# EAGLE schematic sensor (EAGLE 6.5.0)
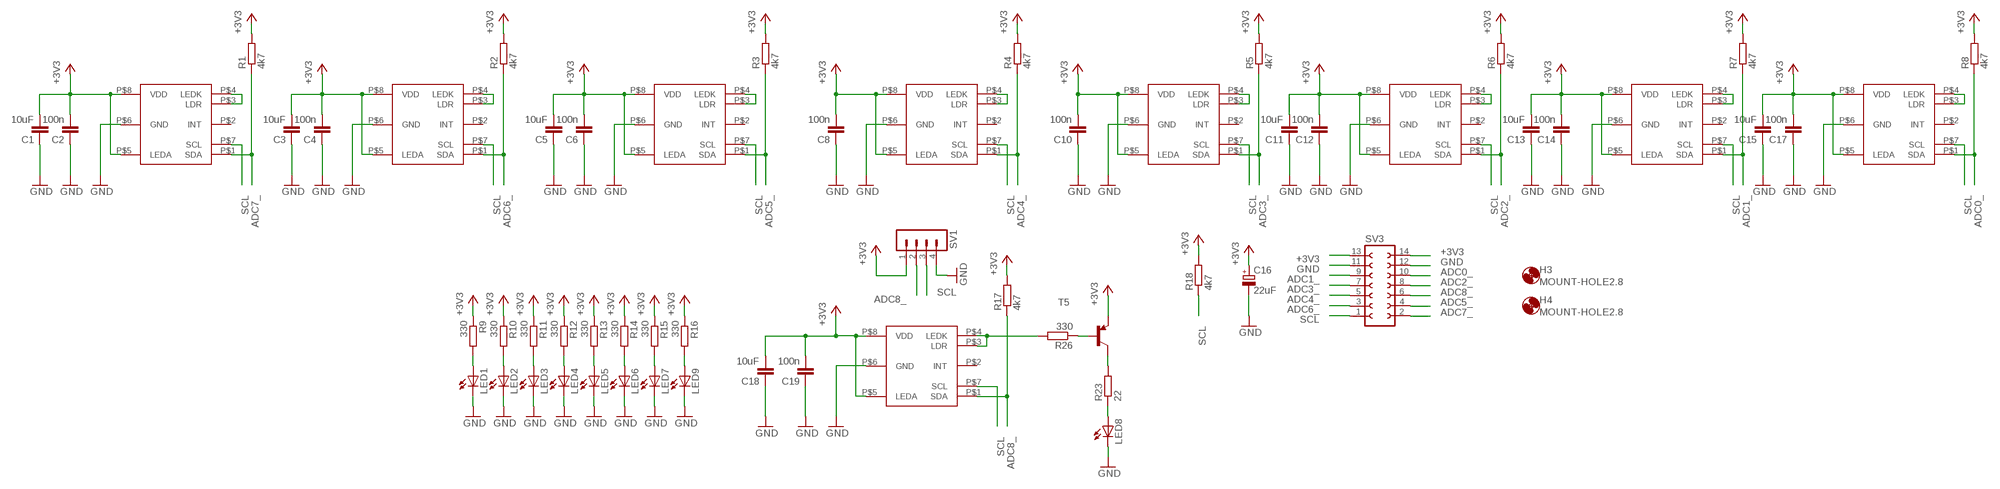
[diagram p0: schematic, sheet 1]

## Parts
C1  10uF  C-EUC0805  [C0805]
C2  100n  C-EUC0805  [C0805]
C3  10uF  C-EUC0805  [C0805]
C4  100n  C-EUC0805  [C0805]
C5  10uF  C-EUC0805  [C0805]
C6  100n  C-EUC0805  [C0805]
C8  100n  C-EUC0805  [C0805]
C10  100n  C-EUC0805  [C0805]
C11  10uF  C-EUC0805  [C0805]
C12  100n  C-EUC0805  [C0805]
C13  10uF  C-EUC0805  [C0805]
C14  100n  C-EUC0805  [C0805]
C15  10uF  C-EUC0805  [C0805]
C16  22uF  CPOL-EU153CLV-0505  [153CLV-0505]
C17  100n  C-EUC0805  [C0805]
C18  10uF  C-EUC0805  [C0805]
C19  100n  C-EUC0805  [C0805]
H3  MOUNT-HOLE2.8  [2,8]
H4  MOUNT-HOLE2.8  [2,8]
LED1  LEDCHIPLED_1206  [CHIPLED_1206]
LED2  LEDCHIPLED_1206  [CHIPLED_1206]
LED3  LEDCHIPLED_1206  [CHIPLED_1206]
LED4  LEDCHIPLED_1206  [CHIPLED_1206]
LED5  LEDCHIPLED_1206  [CHIPLED_1206]
LED6  LEDCHIPLED_1206  [CHIPLED_1206]
LED7  LEDCHIPLED_1206  [CHIPLED_1206]
LED8  LED5MM  [LED5MM]
LED9  LEDCHIPLED_1206  [CHIPLED_1206]
R1  4k7  R-EU_M0805  [M0805]
R2  4k7  R-EU_M0805  [M0805]
R3  4k7  R-EU_M0805  [M0805]
R4  4k7  R-EU_M0805  [M0805]
R5  4k7  R-EU_M0805  [M0805]
R6  4k7  R-EU_M0805  [M0805]
R7  4k7  R-EU_M0805  [M0805]
R8  4k7  R-EU_M0805  [M0805]
R9  330  R-EU_M0805  [M0805]
R10  330  R-EU_M0805  [M0805]
R11  330  R-EU_M0805  [M0805]
R12  330  R-EU_M0805  [M0805]
R13  330  R-EU_M0805  [M0805]
R14  330  R-EU_M0805  [M0805]
R15  330  R-EU_M0805  [M0805]
R16  330  R-EU_M0805  [M0805]
R17  4k7  R-EU_M0805  [M0805]
R18  4k7  R-EU_M0805  [M0805]
R23  22  R-EU_M0805  [M0805]
R26  330  R-EU_M0805  [M0805]
SV1  MA04-1  [MA04-1]
SV3  FE07-2  [FE07-2]
T5  BC857A-PNP-SOT23-BEC  [SOT23-BEC]
U$1  APDS9950  [APDS9950]
U$2  APDS9950_EDGE  [APDS9950_EDGE]
U$4  APDS9950  [APDS9950]
U$5  APDS9950  [APDS9950]
U$6  APDS9950  [APDS9950]
U$7  APDS9950  [APDS9950]
U$8  APDS9950  [APDS9950]
U$9  APDS9950  [APDS9950]
U$10  APDS9950  [APDS9950]

## Nets
+3V3: C1.2 C2.2 C3.2 C4.2 C5.2 C6.2 C8.2 C10.2 C11.2 C12.2 C13.2 C14.2 C15.2 C16.+ C17.2 C18.2 C19.2 R1.2 R2.2 R3.2 R4.2 R5.2 R6.2 R7.2 R8.2 R9.1 R10.1 R11.1 R12.1 R13.1 R14.1 R15.1 R16.1 R17.2 R18.2 SV1.1 SV3.13 SV3.14 T5.E U$1.P$5(LEDA) U$1.P$8(VDD) U$2.P$5(LEDA) U$2.P$8(VDD) U$4.P$5(LEDA) U$4.P$8(VDD) U$5.P$5(LEDA) U$5.P$8(VDD) U$6.P$5(LEDA) U$6.P$8(VDD) U$7.P$5(LEDA) U$7.P$8(VDD) U$8.P$5(LEDA) U$8.P$8(VDD) U$9.P$5(LEDA) U$9.P$8(VDD) U$10.P$5(LEDA) U$10.P$8(VDD)
ADC0_: R8.1 SV3.10 U$10.P$1(SDA)
ADC1_: R7.1 SV3.9 U$9.P$1(SDA)
ADC2_: R6.1 SV3.8 U$8.P$1(SDA)
ADC3_: R5.1 SV3.7 U$7.P$1(SDA)
ADC4_: R4.1 SV3.5 U$6.P$1(SDA)
ADC5_: R3.1 SV3.4 U$5.P$1(SDA)
ADC6_: R2.1 SV3.3 U$4.P$1(SDA)
ADC7_: R1.1 SV3.2 U$1.P$1(SDA)
ADC8_: R17.1 SV1.2 SV3.6 U$2.P$1(SDA)
GND: C1.1 C2.1 C3.1 C4.1 C5.1 C6.1 C8.1 C10.1 C11.1 C12.1 C13.1 C14.1 C15.1 C16.- C17.1 C18.1 C19.1 LED1.C LED2.C LED3.C LED4.C LED5.C LED6.C LED7.C LED8.K(C) LED9.C SV1.4 SV3.11 SV3.12 U$1.P$6(GND) U$2.P$6(GND) U$4.P$6(GND) U$5.P$6(GND) U$6.P$6(GND) U$7.P$6(GND) U$8.P$6(GND) U$9.P$6(GND) U$10.P$6(GND)
N$1: R23.2 T5.C
N$2: U$4.P$3(LDR) U$4.P$4(LEDK)
N$3: LED1.A R9.2
N$4: U$1.P$3(LDR) U$1.P$4(LEDK)
N$5: LED2.A R10.2
N$6: LED3.A R11.2
N$7: LED4.A R12.2
N$8: LED5.A R13.2
N$9: U$5.P$3(LDR) U$5.P$4(LEDK)
N$13: LED6.A R14.2
N$14: LED7.A R15.2
N$15: U$6.P$3(LDR) U$6.P$4(LEDK)
N$16: LED9.A R16.2
N$19: R26.2 U$2.P$3(LDR) U$2.P$4(LEDK)
N$20: U$7.P$3(LDR) U$7.P$4(LEDK)
N$24: U$8.P$3(LDR) U$8.P$4(LEDK)
N$27: U$9.P$3(LDR) U$9.P$4(LEDK)
N$28: LED8.A R23.1
N$31: U$10.P$3(LDR) U$10.P$4(LEDK)
N$32: R26.1 T5.B
SCL: R18.1 SV1.3 SV3.1 U$1.P$7(SCL) U$2.P$7(SCL) U$4.P$7(SCL) U$5.P$7(SCL) U$6.P$7(SCL) U$7.P$7(SCL) U$8.P$7(SCL) U$9.P$7(SCL) U$10.P$7(SCL)
Unconnected: U$1.P$2(INT) U$2.P$2(INT) U$4.P$2(INT) U$5.P$2(INT) U$6.P$2(INT) U$7.P$2(INT) U$8.P$2(INT) U$9.P$2(INT) U$10.P$2(INT)

## Library data of the parts
C1-C6 C8 C10-C15 C17-C19 = resistor:C-EU: CAPACITOR, European symbol
C16 = resistor:CPOL-EU: POLARIZED CAPACITOR, European symbol
H3 H4 = holes:MOUNT-HOLE: MOUNTING HOLE with drill center marker
LED1-LED7 LED9 = my_parts:LED: LED OSRAM: - CHIPLED LG R971, LG N971, LY N971, LG Q971, LY Q971, LO R971, LY R971 LH N974, LH R974 LS Q976, LO Q976, LY Q976 LO Q996 - Hyper CHIPLED LW Q18S LB Q993, LB Q99A, LB R99A - SideLED LS A670, LO A670, LY A670, LG A670, LP A670 LB A673, LV A673, LT A673, LW A673 LH A674 LY A675 LS A676, LA A676, LO A676, LY A676, LW A676 LS A679, LY A679, LG A679 - Hyper Micro SIDELED® LS Y876, LA Y876, LO Y876, LY Y876 LT Y87S - SmartLED LW L88C, LW L88S LB L89C, LB L89S, LG L890 LS L89K, LO L89K, LY L89K LS L896, LA L896, LO L896, LY L896 - TOPLED LS T670, LO T670, LY T670, LG T670, LP T670 LSG T670, LSP T670, LSY T670, LOP T670, LYG T670 LG T671, LOG T671, LSG T671 LB T673, LV T673, LT T673, LW T673 LH T674 LS T676, LA T676, LO T676, LY T676, LB T676, LH T676, LSB T676, LW T676 LB T67C, LV T67C, LT T67C, LS T67K, LO T67K, LY T67K, LW E67C LS E67B, LA E67B, LO E67B, LY E67B, LB E67C, LV E67C, LT E67C LW T67C LS T679, LY T679, LG T679 LS T770, LO T770, LY T770, LG T770, LP T770 LB T773, LV T773, LT T773, LW T773 LH T774 LS E675, LA E675, LY E675, LS T675 LS T776, LA T776, LO T776, LY T776, LB T776 LHGB T686 LT T68C, LB T68C - Hyper Mini TOPLED® LB M676 - Mini TOPLED Santana® LG M470 LS M47K, LO M47K, LY M47K Source: http://www.osram.convergy.de LUXEON: - LUMILED® LXK2-PW12-R00, LXK2-PW12-S00, LXK2-PW14-U00, LXK2-PW14-V00 LXK2-PM12-R00, LXK2-PM12-S00, LXK2-PM14-U00 LXK2-PE12-Q00, LXK2-PE12-R00, LXK2-PE12-S00, LXK2-PE14-T00, LXK2-PE14-U00 LXK2-PB12-K00, LXK2-PB12-L00, LXK2-PB12-M00, LXK2-PB14-N00, LXK2-PB14-P00, LXK2-PB14-Q00 LXK2-PR12-L00, LXK2-PR12-M00, LXK2-PR14-Q00, LXK2-PR14-R00 LXK2-PD12-Q00, LXK2-PD12-R00, LXK2-PD12-S00 LXK2-PH12-R00, LXK2-PH12-S00 LXK2-PL12-P00, LXK2-PL12-Q00, LXK2-PL12-R00 Source: www.luxeon.com KINGBRIGHT: KA-3528ASYC Source: www.kingbright.com
LED8 = led:LED: LED OSRAM: - CHIPLED LG R971, LG N971, LY N971, LG Q971, LY Q971, LO R971, LY R971 LH N974, LH R974 LS Q976, LO Q976, LY Q976 LO Q996 - Hyper CHIPLED LW Q18S LB Q993, LB Q99A, LB R99A - SideLED LS A670, LO A670, LY A670, LG A670, LP A670 LB A673, LV A673, LT A673, LW A673 LH A674 LY A675 LS A676, LA A676, LO A676, LY A676, LW A676 LS A679, LY A679, LG A679 - Hyper Micro SIDELED® LS Y876, LA Y876, LO Y876, LY Y876 LT Y87S - SmartLED LW L88C, LW L88S LB L89C, LB L89S, LG L890 LS L89K, LO L89K, LY L89K LS L896, LA L896, LO L896, LY L896 - TOPLED LS T670, LO T670, LY T670, LG T670, LP T670 LSG T670, LSP T670, LSY T670, LOP T670, LYG T670 LG T671, LOG T671, LSG T671 LB T673, LV T673, LT T673, LW T673 LH T674 LS T676, LA T676, LO T676, LY T676, LB T676, LH T676, LSB T676, LW T676 LB T67C, LV T67C, LT T67C, LS T67K, LO T67K, LY T67K, LW E67C LS E67B, LA E67B, LO E67B, LY E67B, LB E67C, LV E67C, LT E67C LW T67C LS T679, LY T679, LG T679 LS T770, LO T770, LY T770, LG T770, LP T770 LB T773, LV T773, LT T773, LW T773 LH T774 LS E675, LA E675, LY E675, LS T675 LS T776, LA T776, LO T776, LY T776, LB T776 LHGB T686 LT T68C, LB T68C - Hyper Mini TOPLED® LB M676 - Mini TOPLED Santana® LG M470 LS M47K, LO M47K, LY M47K Source: http://www.osram.convergy.de LUXEON: - LUMILED® LXK2-PW12-R00, LXK2-PW12-S00, LXK2-PW14-U00, LXK2-PW14-V00 LXK2-PM12-R00, LXK2-PM12-S00, LXK2-PM14-U00 LXK2-PE12-Q00, LXK2-PE12-R00, LXK2-PE12-S00, LXK2-PE14-T00, LXK2-PE14-U00 LXK2-PB12-K00, LXK2-PB12-L00, LXK2-PB12-M00, LXK2-PB14-N00, LXK2-PB14-P00, LXK2-PB14-Q00 LXK2-PR12-L00, LXK2-PR12-M00, LXK2-PR14-Q00, LXK2-PR14-R00 LXK2-PD12-Q00, LXK2-PD12-R00, LXK2-PD12-S00 LXK2-PH12-R00, LXK2-PH12-S00 LXK2-PL12-P00, LXK2-PL12-Q00, LXK2-PL12-R00 Source: www.luxeon.com KINGBRIGHT: KA-3528ASYC Source: www.kingbright.com
R1-R18 R23 R26 = resistor:R-EU_: RESISTOR, European symbol
SV1 = con-lstb:MA04-1: PIN HEADER; OC_FARNELL: unknown; OC_NEWARK: unknown
SV3 = con-lsta:FE07-2: FEMALE HEADER; OC_FARNELL: unknown; OC_NEWARK: unknown
T5 = transistor:*-PNP-: PNP Transistror
U$1 U$4-U$10 = my_parts:APDS9950
U$2 = my_parts:APDS9950_EDGE